# Altium schematic sheet main.SchDoc
size A4; DocumentNumber: 1; SheetNumber: 1; SheetTotal: 5
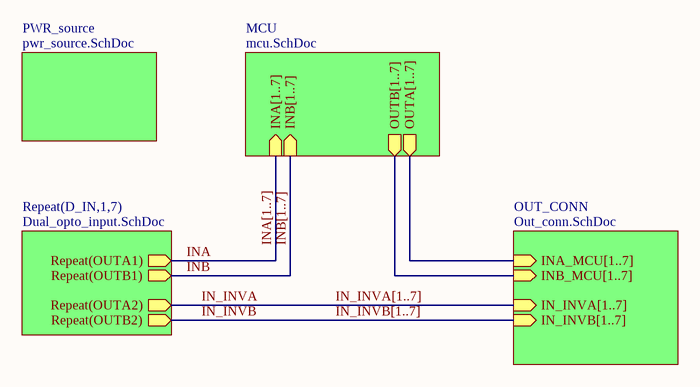
[diagram p0: main.SchDoc]

## Sub-sheets
MCU = mcu.SchDoc: INA[1..7] (in), INB[1..7] (in), OUTB[1..7] (out), OUTA[1..7] (out)
OUT_CONN = Out_conn.SchDoc: IN_INVA[1..7] (in), IN_INVB[1..7] (in), INA_MCU[1..7] (in), INB_MCU[1..7] (in)
PWR_source = pwr_source.SchDoc: no entries
Repeat(D_IN,1,7) = Dual_opto_input.SchDoc: Repeat(OUTA1) (out), Repeat(OUTB1) (out), Repeat(OUTA2) (out), Repeat(OUTB2) (out)

## Nets
IN_INVA: sheet Repeat(D_IN,1,7)/Repeat(OUTA2)
IN_INVB: sheet Repeat(D_IN,1,7)/Repeat(OUTB2)
INA: sheet Repeat(D_IN,1,7)/Repeat(OUTA1)
INB: sheet Repeat(D_IN,1,7)/Repeat(OUTB1)

## Buses and harness runs
bus IN_INVA[1..7] = sheet OUT_CONN/IN_INVA[1..7]
bus IN_INVB[1..7] = sheet OUT_CONN/IN_INVB[1..7]
bus INA[1..7] = sheet MCU/INA[1..7]
bus INB[1..7] = sheet MCU/INB[1..7]
bus sheet MCU/OUTA[1..7] = sheet OUT_CONN/INA_MCU[1..7]
bus sheet MCU/OUTB[1..7] = sheet OUT_CONN/INB_MCU[1..7]